# Altium schematic sheet ecu-side-schematic.SchDoc: ECU-side conditioning / isolation
size A; Author: wgbowley; CompanyName: RMIT Motorsports; DrawnBy: wgbowley; Engineer: wgbowley
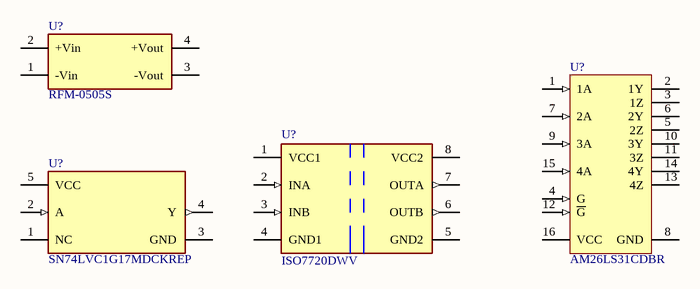
[diagram p0: ecu-side-schematic.SchDoc]

## Parts
(Parts that share a designator on the sheet are numbered #1, #2 ... from top to bottom, then left to right.)
U?#1  RFM-0505S  [FP-RFM-0505S-MFG]
U?#2  AM26LS31CDBR  [DB0016A_M]
U?#3  ISO7720DWV  [FP-DWV0008A-IPC_B]
U?#4  SN74LVC1G17MDCKREP  [FP-DCK0005A-IPC_A]

## Nets

Not connected (* = marked no-connect by the designer): U?#1 1(-Vin) 2(+Vin) 3(-Vout) 4(+Vout); U?#2 1(1A) 2(1Y) 3(1Z) 4(G) 5(2Z) 6(2Y) 7(2A) 8(GND) 9(3A) 10(3Y) 11(3Z) 12(~{G}) 13(4Z) 14(4Y) 15(4A) 16(VCC); U?#3 1(VCC1) 2(INA) 3(INB) 4(GND1) 5(GND2) 6(OUTB) 7(OUTA) 8(VCC2); U?#4 1(NC) 2(A) 3(GND) 4(Y) 5(VCC)

## Library data of the parts
U?#1 = CMP-29842-000017-1: DC DC CONVERTER 5V 1W; Height: 10mm; Width: 6mm; Max Output Voltage: 5V; Length: 11.5mm; Weight: 1.4g
U?#2 = CMP-0310-00496-2: Quadruple Differential Line Driver, 4 TX / 0 RX, 5V, 0 to 70 degC, 16-Pin SSOP (DB), Green (RoHS & no Sb/Br); Manufacturer: Texas Instruments; SubFamily: RS-422; Rating: Catalog; Drivers Per Package: 4; ICC(Max)(mA): 80; Supply Voltage(s)(V): 5; ESD(kV): 2; PackageReference: DB0016A; ComponentLink1Description: Datasheet; Mounting Technology: Surface Mount; DatasheetVersion: SLLS114I; PackageDescription: 16-Pin Plastic Small Outline Package, 6.2 x 5.3 mm Body, 0.65 mm Pitch; ComponentLink2Description: Package Specification; Footprint: AM26LS31; Eco-Plan: Green (RoHS & no Sb/Br); ComponentLink2URL: http://www.ti.com/lit/ml/msso002e/msso002e.pdf; PackageVersion: revE, Dec-2001; Code_JEDEC: MO-150; PartNumber: AM26LS31CDBR; # of TX/RX: 4 TX / 0 RX; ComponentLink1URL: http://www.ti.com/general/docs/lit/getliterature.tsp?genericPartNumber=AM26LS31&fileType=pdf
U?#3 = CMP-04872-000164-1: DGTL ISO 5000VRMS 2CH GP 8SOIC; Number of Channels: 2; Isolated Power: No; Channel Type: Unidirectional; Propagation Delay: 16ns; Data Rate: 100Mbps; Pulse Width Distortion (PWD): 4.9ns; Mount: Surface Mount; Type: General Purpose; Case/Package: SOIC; Min Operating Temperature: -55°C; RoHS Compliant: Yes; Max Operating Temperature: 125°C
U?#4 = CMP-0859-00386-5: IC BUF NON-INVERT 5.5V SC70-5; Quiescent Current: 10uA; Number of Elements: 1; Turn-On Delay Time: 11ns; High Level Output Current: -32mA; Low Level Output Current: 32mA; Polarity: Non-Inverting; Logic Function: Schmitt Trigger; Min Supply Voltage: 1.65V; Propagation Delay: 5ns; Lead Free: Lead Free; Min Operating Temperature: -55°C; Mount: Surface Mount; Max Operating Temperature: 125°C; Case/Package: SC; Radiation Hardening: No; RoHS Compliant: Yes; Number of Bits: 1; Technology: CMOS; REACH SVHC: No SVHC; Max Supply Voltage: 5.5V; Series: 74LVC; Number of Bits per Element: 1; Number of Channels: 1; Number of Output Lines: 1; Number of Outputs: 1; Number of Input Lines: 1; Number of Pins: 5; Package Quantity: 3000; Contact Plating: Gold; Packaging: Tape and Reel; Number of Inputs: 1